# Altium project ECSC2024-pizza.PrjPcb
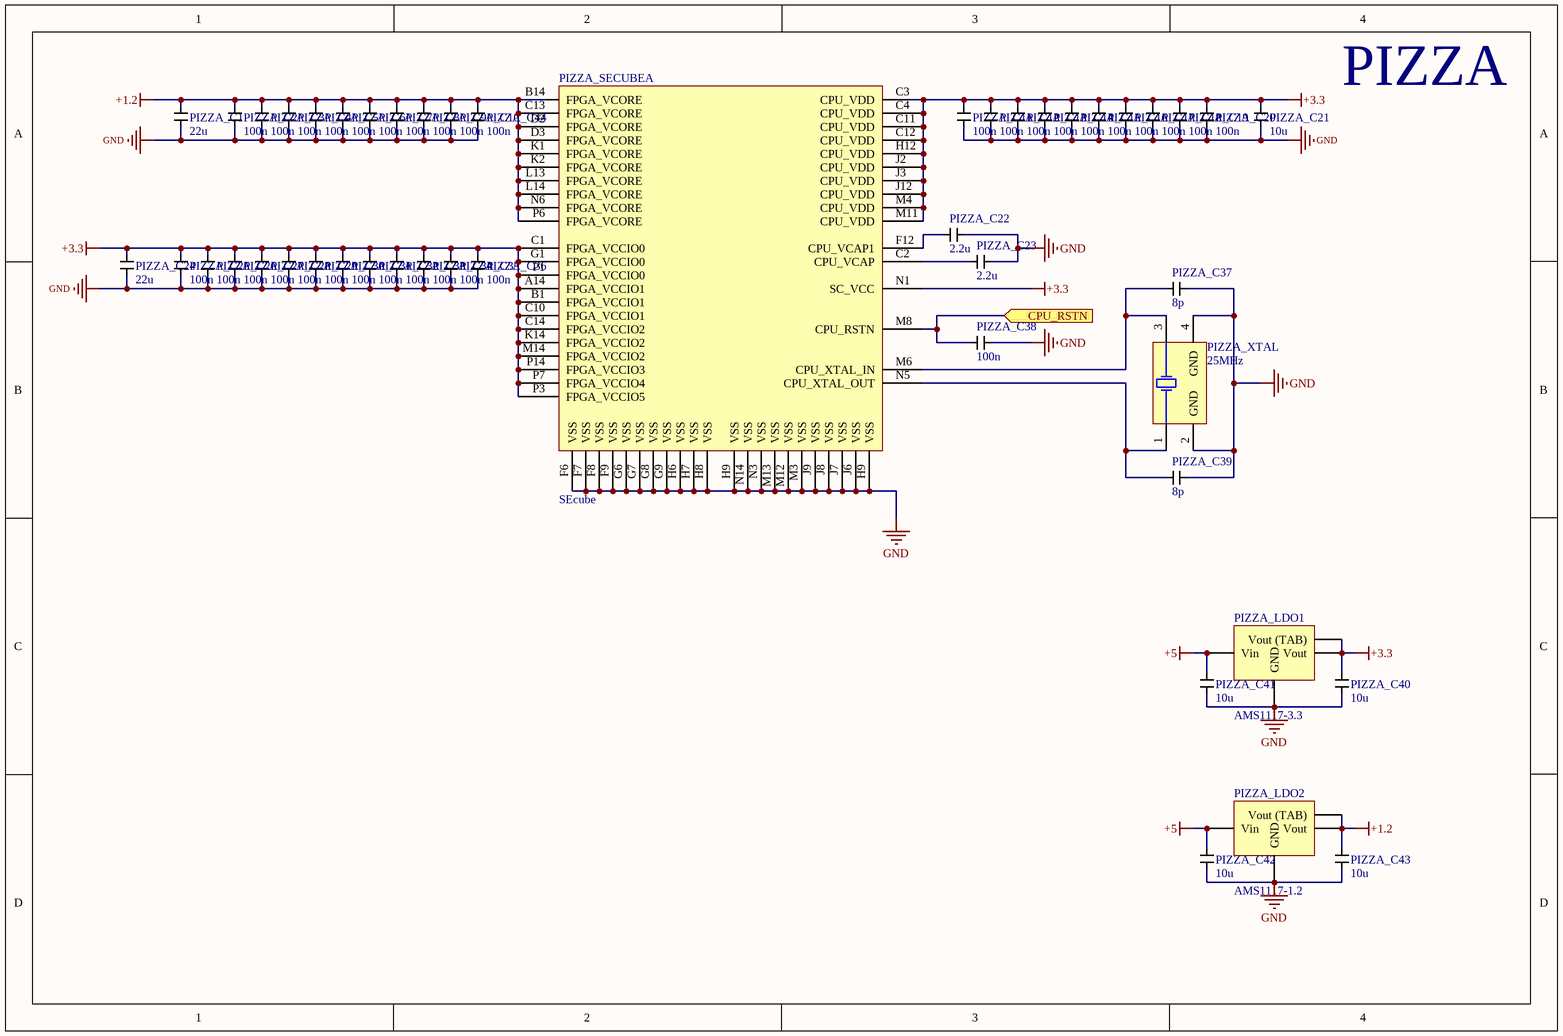
[diagram p0: Pizza BASE.SchDoc]
2 sheets, 75 parts. Net scope: flat (ports and power ports of the same name join across sheets).
Board files: Pizza.PcbDoc, PizzaFull.PcbDoc
Sheets:
  Pizza BASE.SchDoc
  Pizza IO.SchDoc

## Sheet Pizza BASE.SchDoc: Pizza CPU BASE
size A4; Author: Giovanni Minotti; SheetNumber: 1; SheetTotal: 2; ENG_APP_DATE: --/--/--; DSN_APP_DATE: --/--/--; CHK_APP_DATE: --/--/--

### Parts
PIZZA_C1  22u  [C0402]
PIZZA_C2  100n  [C0201]
PIZZA_C3  100n  [C0201]
PIZZA_C4  100n  [C0201]
PIZZA_C5  100n  [C0201]
PIZZA_C6  100n  [C0201]
PIZZA_C7  100n  [C0201]
PIZZA_C8  100n  [C0201]
PIZZA_C9  100n  [C0201]
PIZZA_C10  100n  [C0201]
PIZZA_C11  100n  [C0201]
PIZZA_C12  100n  [C0201]
PIZZA_C13  100n  [C0201]
PIZZA_C14  100n  [C0201]
PIZZA_C15  100n  [C0201]
PIZZA_C16  100n  [C0201]
PIZZA_C17  100n  [C0201]
PIZZA_C18  100n  [C0201]
PIZZA_C19  100n  [C0201]
PIZZA_C20  100n  [C0201]
PIZZA_C21  10u  [C0402]
PIZZA_C22  2.2u  [C0402]
PIZZA_C23  2.2u  [C0402]
PIZZA_C24  22u  [C0402]
PIZZA_C25  100n  [C0201]
PIZZA_C26  100n  [C0201]
PIZZA_C27  100n  [C0201]
PIZZA_C28  100n  [C0201]
PIZZA_C29  100n  [C0201]
PIZZA_C30  100n  [C0201]
PIZZA_C31  100n  [C0201]
PIZZA_C32  100n  [C0201]
PIZZA_C33  100n  [C0201]
PIZZA_C34  100n  [C0201]
PIZZA_C35  100n  [C0201]
PIZZA_C36  100n  [C0201]
PIZZA_C37  8p  [C0402]
PIZZA_C38  100n  [C0201]
PIZZA_C39  8p  [C0402]
PIZZA_C40  10u  [C0402]
PIZZA_C41  10u  [C0402]
PIZZA_C42  10u  [C0402]
PIZZA_C43  10u  [C0402]
PIZZA_C44  100n  [C0201]
PIZZA_LDO1  AMS1117-3.3  [SOT-223]
PIZZA_LDO2  AMS1117-1.2  [SOT-223]
PIZZA_SECUBE  SEcube  [SEcube]  (part A of 4)
PIZZA_XTAL  25MHz  [TSX-3225]

### Ports
CPU_RSTN (in, see Pizza IO[1C], Pizza IO[4D])

### Nets
+1.2: PIZZA_C1.2 PIZZA_C2.2 PIZZA_C3.2 PIZZA_C4.2 PIZZA_C5.2 PIZZA_C6.2 PIZZA_C7.2 PIZZA_C8.2 PIZZA_C9.2 PIZZA_C10.2 PIZZA_C43.2 PIZZA_C44.2 PIZZA_LDO2.3(Vout) PIZZA_LDO2.4(Vout_(TAB)) PIZZA_SECUBE.B14(FPGA_VCORE) PIZZA_SECUBE.C13(FPGA_VCORE) PIZZA_SECUBE.D2(FPGA_VCORE) PIZZA_SECUBE.D3(FPGA_VCORE) PIZZA_SECUBE.K1(FPGA_VCORE) PIZZA_SECUBE.K2(FPGA_VCORE) PIZZA_SECUBE.L13(FPGA_VCORE) PIZZA_SECUBE.L14(FPGA_VCORE) PIZZA_SECUBE.N6(FPGA_VCORE) PIZZA_SECUBE.P6(FPGA_VCORE)
+3.3: PIZZA_C11.2 PIZZA_C12.2 PIZZA_C13.2 PIZZA_C14.2 PIZZA_C15.2 PIZZA_C16.2 PIZZA_C17.2 PIZZA_C18.2 PIZZA_C19.2 PIZZA_C20.2 PIZZA_C21.2 PIZZA_C24.2 PIZZA_C25.2 PIZZA_C26.2 PIZZA_C27.2 PIZZA_C28.2 PIZZA_C29.2 PIZZA_C30.2 PIZZA_C31.2 PIZZA_C32.2 PIZZA_C33.2 PIZZA_C34.2 PIZZA_C35.2 PIZZA_C36.2 PIZZA_C40.2 PIZZA_LDO1.3(Vout) PIZZA_LDO1.4(Vout_(TAB)) PIZZA_SECUBE.A14(FPGA_VCCIO1) PIZZA_SECUBE.B1(FPGA_VCCIO1) PIZZA_SECUBE.C1(FPGA_VCCIO0) PIZZA_SECUBE.C3(CPU_VDD) PIZZA_SECUBE.C4(CPU_VDD) PIZZA_SECUBE.C10(FPGA_VCCIO1) PIZZA_SECUBE.C11(CPU_VDD) PIZZA_SECUBE.C12(CPU_VDD) PIZZA_SECUBE.C14(FPGA_VCCIO2) PIZZA_SECUBE.G1(FPGA_VCCIO0) PIZZA_SECUBE.H12(CPU_VDD) PIZZA_SECUBE.J2(CPU_VDD) PIZZA_SECUBE.J3(CPU_VDD) PIZZA_SECUBE.J12(CPU_VDD) PIZZA_SECUBE.K14(FPGA_VCCIO2) PIZZA_SECUBE.M4(CPU_VDD) PIZZA_SECUBE.M11(CPU_VDD) PIZZA_SECUBE.M14(FPGA_VCCIO2) PIZZA_SECUBE.N1(SC_VCC) PIZZA_SECUBE.P1(FPGA_VCCIO0) PIZZA_SECUBE.P3(FPGA_VCCIO5) PIZZA_SECUBE.P7(FPGA_VCCIO4) PIZZA_SECUBE.P14(FPGA_VCCIO3)
+5: PIZZA_C41.2 PIZZA_C42.2 PIZZA_LDO1.2(Vin) PIZZA_LDO2.2(Vin)
GND: PIZZA_C1.1 PIZZA_C2.1 PIZZA_C3.1 PIZZA_C4.1 PIZZA_C5.1 PIZZA_C6.1 PIZZA_C7.1 PIZZA_C8.1 PIZZA_C9.1 PIZZA_C10.1 PIZZA_C11.1 PIZZA_C12.1 PIZZA_C13.1 PIZZA_C14.1 PIZZA_C15.1 PIZZA_C16.1 PIZZA_C17.1 PIZZA_C18.1 PIZZA_C19.1 PIZZA_C20.1 PIZZA_C21.1 PIZZA_C22.1 PIZZA_C23.1 PIZZA_C24.1 PIZZA_C25.1 PIZZA_C26.1 PIZZA_C27.1 PIZZA_C28.1 PIZZA_C29.1 PIZZA_C30.1 PIZZA_C31.1 PIZZA_C32.1 PIZZA_C33.1 PIZZA_C34.1 PIZZA_C35.1 PIZZA_C36.1 PIZZA_C37.2 PIZZA_C38.1 PIZZA_C39.2 PIZZA_C40.1 PIZZA_C41.1 PIZZA_C42.1 PIZZA_C43.1 PIZZA_C44.1 PIZZA_LDO1.1(GND) PIZZA_LDO2.1(GND) PIZZA_SECUBE.F6(VSS) PIZZA_SECUBE.F7(VSS) PIZZA_SECUBE.F8(VSS) PIZZA_SECUBE.F9(VSS) PIZZA_SECUBE.G6(VSS) PIZZA_SECUBE.G7(VSS) PIZZA_SECUBE.G8(VSS) PIZZA_SECUBE.G9(VSS) PIZZA_SECUBE.H6(VSS) PIZZA_SECUBE.H7(VSS) PIZZA_SECUBE.H8(VSS) PIZZA_SECUBE.H9(VSS) PIZZA_SECUBE.J6(VSS) PIZZA_SECUBE.J7(VSS) PIZZA_SECUBE.J8(VSS) PIZZA_SECUBE.J9(VSS) PIZZA_SECUBE.M3(VSS) PIZZA_SECUBE.M12(VSS) PIZZA_SECUBE.M13(VSS) PIZZA_SECUBE.N3(VSS) PIZZA_SECUBE.N14(VSS) PIZZA_XTAL.2(GND) PIZZA_XTAL.4(GND)
NetPIZZA_C22_2: PIZZA_C22.2 PIZZA_SECUBE.F12(CPU_VCAP1)
NetPIZZA_C23_2: PIZZA_C23.2 PIZZA_SECUBE.C2(CPU_VCAP)
NetPIZZA_C37_1: PIZZA_C37.1 PIZZA_SECUBE.M6(CPU_XTAL_IN) PIZZA_XTAL.3(X2)
NetPIZZA_C38_2: PIZZA_C38.2 PIZZA_SECUBE.M8(CPU_RSTN) ; port CPU_RSTN
NetPIZZA_C39_1: PIZZA_C39.1 PIZZA_SECUBE.N5(CPU_XTAL_OUT) PIZZA_XTAL.1(X1)

### Notes on the sheet
- PIZZA
- DWG. NO.
- REV.
- SHT.
- THIS DOCUMENT AND THE DATA DISCLOSED HEREIN OR HEREWITH IS THE PROPERTY OF ALTIUM LIMITED AND MAY BE FREELY DISTRIBUTED IN WHOLE. NO RIGHTS ARE RESERVED OR EXPRESS OR IMPLIED WARANTEE GIVEN.
- REVISION
- DESCRIPTION
- DATE
- APPROVED
- ENG:
- APPROVALS
- PROJECT
- DSN:
- CHK:
- REFERENCE DOCUMENTS
- PROJECT REVISION:
- TITLE
- DOCUMENT REVISION:
- DESIGN ITEM:
- BOM:
- FAB DWG:
- PCB DWG:
- ASSY DWG:
- SCALE:
- SIZE
- B
- CAGE CODE
- FILE NAME
- DWG NO.
- SHEET
- OF
- REV

### Library data of the parts
PIZZA_C1-PIZZA_C44 = C
PIZZA_LDO1 PIZZA_LDO2 = LDO
PIZZA_XTAL = XTAL

## Sheet Pizza IO.SchDoc: Pizza CHALLENGES
size A4; Author: Giovanni Minotti; SheetNumber: 2; SheetTotal: 2
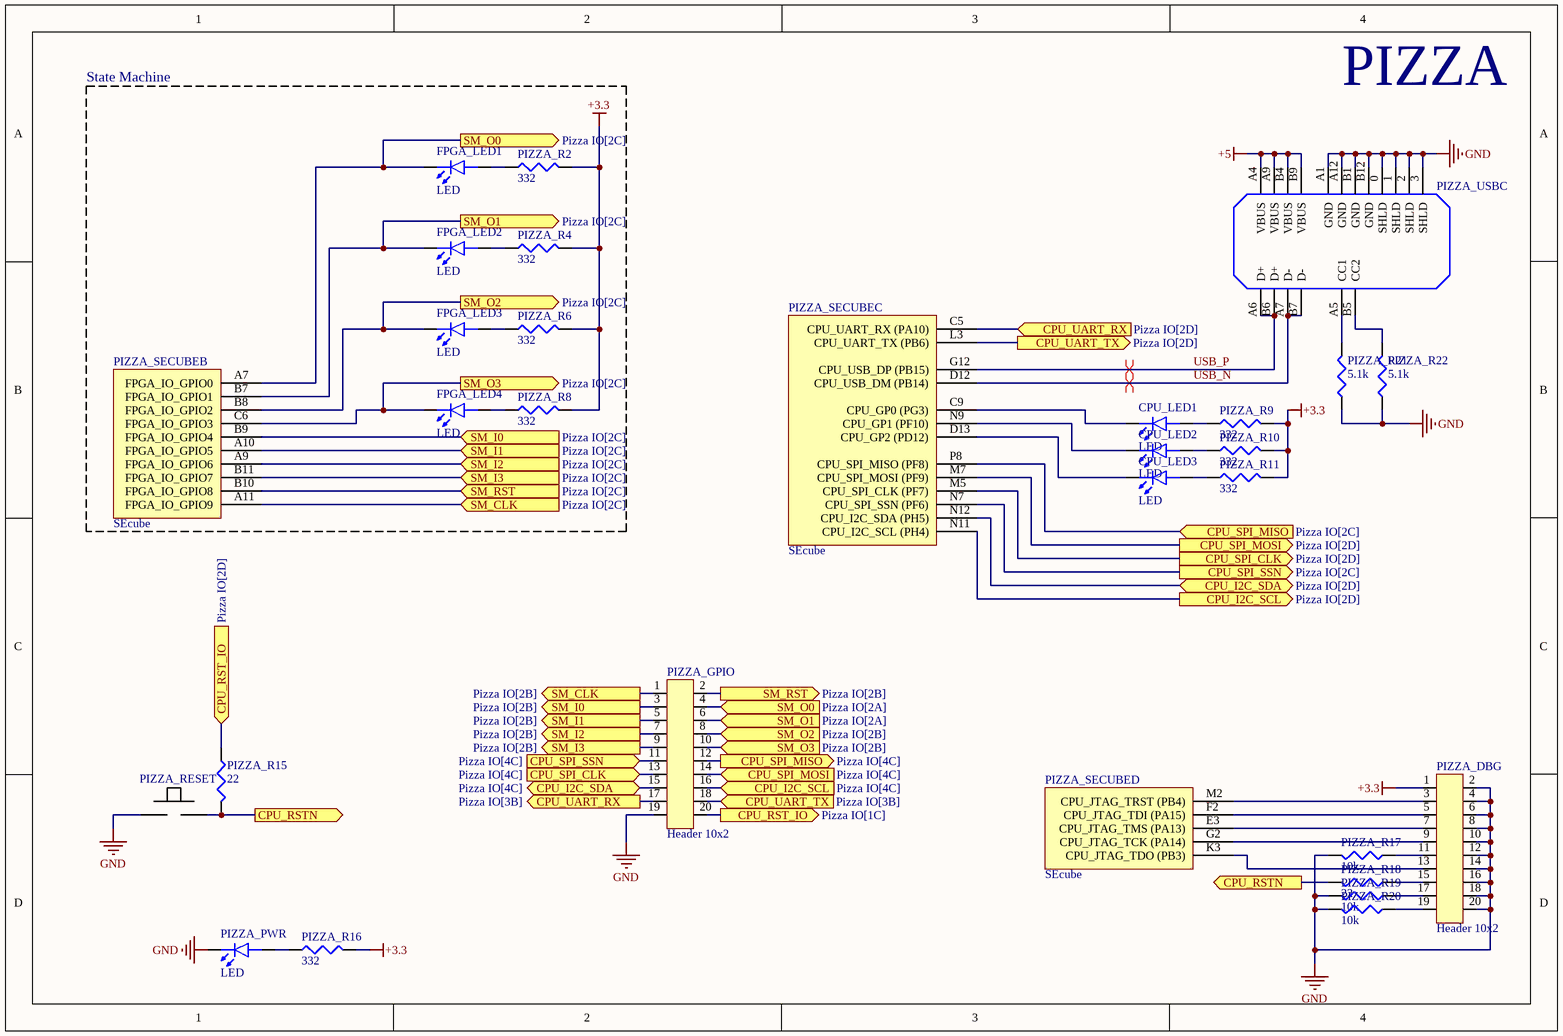
[diagram p1: Pizza IO.SchDoc]

### Parts
CPU_LED1  LED  [LED0603P]
CPU_LED2  LED  [LED0603P]
CPU_LED3  LED  [LED0603P]
FPGA_LED1  LED  [LED0603P]
FPGA_LED2  LED  [LED0603P]
FPGA_LED3  LED  [LED0603P]
FPGA_LED4  LED  [LED0603P]
PIZZA_DBG  Header 10x2  [HEADER10x2]
PIZZA_GPIO  Header 10x2  [HEADER10x2]
PIZZA_PWR  LED  [LED0603P]
PIZZA_R2  332  [R0402]
PIZZA_R4  332  [R0402]
PIZZA_R6  332  [R0402]
PIZZA_R8  332  [R0402]
PIZZA_R9  332  [R0402]
PIZZA_R10  332  [R0402]
PIZZA_R11  332  [R0402]
PIZZA_R15  22  [R0402]
PIZZA_R16  332  [R0402]
PIZZA_R17  10k  [R0402]
PIZZA_R18  22  [R0402]
PIZZA_R19  10k  [R0402]
PIZZA_R20  10k  [R0402]
PIZZA_R21  5.1k  [R0402]
PIZZA_R22  5.1k  [R0402]
PIZZA_RESET  BTN  [TS1088AR02016]  (value not drawn)
PIZZA_SECUBE  SEcube  [SEcube]  (parts B,C,D of 4)
PIZZA_USBC  USBC  [USB-TYPE-C-018]  (value not drawn)

### Blocks framed on the sheet
State Machine: FPGA_LED1-FPGA_LED4 PIZZA_R2 PIZZA_R4 PIZZA_R6 PIZZA_R8 PIZZA_SECUBE

### Ports
CPU_I2C_SCL (in, see Pizza IO[4C]), CPU_I2C_SCL (out, see Pizza IO[2D]), CPU_I2C_SDA (bidir, see Pizza IO[2D]), CPU_I2C_SDA (bidir, see Pizza IO[4C]), CPU_RST_IO (in, see Pizza IO[2D]), CPU_RST_IO (out, see Pizza IO[1C]), CPU_RSTN (out, see Pizza BASE[3B], Pizza IO[1D]), CPU_RSTN (out, see Pizza BASE[3B], Pizza IO[4D]), CPU_SPI_CLK (in, see Pizza IO[4C]), CPU_SPI_CLK (out, see Pizza IO[2D]), CPU_SPI_MISO (in, see Pizza IO[2C]), CPU_SPI_MISO (out, see Pizza IO[4C]), CPU_SPI_MOSI (in, see Pizza IO[4C]), CPU_SPI_MOSI (out, see Pizza IO[2D]), CPU_SPI_SSN (in, see Pizza IO[4C]), CPU_SPI_SSN (out, see Pizza IO[2C]), CPU_UART_RX (in, see Pizza IO[2D]), CPU_UART_RX (out, see Pizza IO[3B]), CPU_UART_TX (in, see Pizza IO[3B]), CPU_UART_TX (out, see Pizza IO[2D]), SM_CLK (in, see Pizza IO[2C]), SM_CLK (out, see Pizza IO[2B]), SM_I0 (in, see Pizza IO[2C]), SM_I0 (out, see Pizza IO[2B]), SM_I1 (in, see Pizza IO[2C]), SM_I1 (out, see Pizza IO[2B]), SM_I2 (in, see Pizza IO[2C]), SM_I2 (out, see Pizza IO[2B]), SM_I3 (in, see Pizza IO[2C]), SM_I3 (out, see Pizza IO[2B]), SM_O0 (in, see Pizza IO[2A]), SM_O0 (out, see Pizza IO[2C]), SM_O1 (in, see Pizza IO[2A]), SM_O1 (out, see Pizza IO[2C]), SM_O2 (in, see Pizza IO[2B]), SM_O2 (out, see Pizza IO[2C]), SM_O3 (in, see Pizza IO[2B]), SM_O3 (out, see Pizza IO[2C]), SM_RST (in, see Pizza IO[2C]), SM_RST (out, see Pizza IO[2B])

### Nets
+3.3: PIZZA_DBG.1 PIZZA_R2.2 PIZZA_R4.2 PIZZA_R6.2 PIZZA_R8.2 PIZZA_R9.2 PIZZA_R10.2 PIZZA_R11.2 PIZZA_R16.2
+5: PIZZA_USBC.A4(VBUS) PIZZA_USBC.A9(VBUS) PIZZA_USBC.B4(VBUS) PIZZA_USBC.B9(VBUS)
GND: PIZZA_DBG.2 PIZZA_DBG.4 PIZZA_DBG.6 PIZZA_DBG.8 PIZZA_DBG.10 PIZZA_DBG.12 PIZZA_DBG.14 PIZZA_DBG.16 PIZZA_DBG.18 PIZZA_DBG.20 PIZZA_GPIO.19 PIZZA_PWR.2(K) PIZZA_R17.2 PIZZA_R19.2 PIZZA_R20.2 PIZZA_R21.1 PIZZA_R22.1 PIZZA_RESET.1 PIZZA_USBC.0(SHLD) PIZZA_USBC.1(SHLD) PIZZA_USBC.2(SHLD) PIZZA_USBC.3(SHLD) PIZZA_USBC.A1(GND) PIZZA_USBC.A12(GND) PIZZA_USBC.B1(GND) PIZZA_USBC.B12(GND)
USB_N: PIZZA_SECUBE.D12(CPU_USB_DM_(PB14)) PIZZA_USBC.A7(D-) PIZZA_USBC.B7(D-)
USB_P: PIZZA_SECUBE.G12(CPU_USB_DP_(PB15)) PIZZA_USBC.A6(D+) PIZZA_USBC.B6(D+)
NetCPU_LED1_1: CPU_LED1.1(A) PIZZA_R9.1
NetCPU_LED1_2: CPU_LED1.2(K) PIZZA_SECUBE.C9(CPU_GP0_(PG3))
NetCPU_LED2_1: CPU_LED2.1(A) PIZZA_R10.1
NetCPU_LED2_2: CPU_LED2.2(K) PIZZA_SECUBE.N9(CPU_GP1_(PF10))
NetCPU_LED3_1: CPU_LED3.1(A) PIZZA_R11.1
NetCPU_LED3_2: CPU_LED3.2(K) PIZZA_SECUBE.D13(CPU_GP2_(PD12))
NetFPGA_LED1_1: FPGA_LED1.1(A) PIZZA_R2.1
NetFPGA_LED1_2: FPGA_LED1.2(K) PIZZA_GPIO.4 PIZZA_SECUBE.A7(FPGA_IO_GPIO0) ; port SM_O0
NetFPGA_LED2_1: FPGA_LED2.1(A) PIZZA_R4.1
NetFPGA_LED2_2: FPGA_LED2.2(K) PIZZA_GPIO.6 PIZZA_SECUBE.B7(FPGA_IO_GPIO1) ; port SM_O1
NetFPGA_LED3_1: FPGA_LED3.1(A) PIZZA_R6.1
NetFPGA_LED3_2: FPGA_LED3.2(K) PIZZA_GPIO.8 PIZZA_SECUBE.B8(FPGA_IO_GPIO2) ; port SM_O2
NetFPGA_LED4_1: FPGA_LED4.1(A) PIZZA_R8.1
NetFPGA_LED4_2: FPGA_LED4.2(K) PIZZA_GPIO.10 PIZZA_SECUBE.C6(FPGA_IO_GPIO3) ; port SM_O3
NetPIZZA_C38_2: PIZZA_R15.2 PIZZA_R18.2 PIZZA_RESET.2 ; port CPU_RSTN
NetPIZZA_DBG_3: PIZZA_DBG.3 PIZZA_SECUBE.M2(CPU_JTAG_TRST_(PB4))
NetPIZZA_DBG_5: PIZZA_DBG.5 PIZZA_SECUBE.F2(CPU_JTAG_TDI_(PA15))
NetPIZZA_DBG_7: PIZZA_DBG.7 PIZZA_SECUBE.E3(CPU_JTAG_TMS_(PA13))
NetPIZZA_DBG_9: PIZZA_DBG.9 PIZZA_SECUBE.G2(CPU_JTAG_TCK_(PA14))
NetPIZZA_DBG_11: PIZZA_DBG.11 PIZZA_R17.1
NetPIZZA_DBG_13: PIZZA_DBG.13 PIZZA_SECUBE.K3(CPU_JTAG_TDO_(PB3))
NetPIZZA_DBG_15: PIZZA_DBG.15 PIZZA_R18.1
NetPIZZA_DBG_17: PIZZA_DBG.17 PIZZA_R19.1
NetPIZZA_DBG_19: PIZZA_DBG.19 PIZZA_R20.1
NetPIZZA_GPIO_1: PIZZA_GPIO.1 PIZZA_SECUBE.A11(FPGA_IO_GPIO9) ; port SM_CLK
NetPIZZA_GPIO_2: PIZZA_GPIO.2 PIZZA_SECUBE.B10(FPGA_IO_GPIO8) ; port SM_RST
NetPIZZA_GPIO_3: PIZZA_GPIO.3 PIZZA_SECUBE.B9(FPGA_IO_GPIO4) ; port SM_I0
NetPIZZA_GPIO_5: PIZZA_GPIO.5 PIZZA_SECUBE.A10(FPGA_IO_GPIO5) ; port SM_I1
NetPIZZA_GPIO_7: PIZZA_GPIO.7 PIZZA_SECUBE.A9(FPGA_IO_GPIO6) ; port SM_I2
NetPIZZA_GPIO_9: PIZZA_GPIO.9 PIZZA_SECUBE.B11(FPGA_IO_GPIO7) ; port SM_I3
NetPIZZA_GPIO_11: PIZZA_GPIO.11 PIZZA_SECUBE.N7(CPU_SPI_SSN_(PF6)) ; port CPU_SPI_SSN
NetPIZZA_GPIO_12: PIZZA_GPIO.12 PIZZA_SECUBE.P8(CPU_SPI_MISO_(PF8)) ; port CPU_SPI_MISO
NetPIZZA_GPIO_13: PIZZA_GPIO.13 PIZZA_SECUBE.M5(CPU_SPI_CLK_(PF7)) ; port CPU_SPI_CLK
NetPIZZA_GPIO_14: PIZZA_GPIO.14 PIZZA_SECUBE.M7(CPU_SPI_MOSI_(PF9)) ; port CPU_SPI_MOSI
NetPIZZA_GPIO_15: PIZZA_GPIO.15 PIZZA_SECUBE.N12(CPU_I2C_SDA_(PH5)) ; port CPU_I2C_SDA
NetPIZZA_GPIO_16: PIZZA_GPIO.16 PIZZA_SECUBE.N11(CPU_I2C_SCL_(PH4)) ; port CPU_I2C_SCL
NetPIZZA_GPIO_17: PIZZA_GPIO.17 PIZZA_SECUBE.C5(CPU_UART_RX_(PA10)) ; port CPU_UART_RX
NetPIZZA_GPIO_18: PIZZA_GPIO.18 PIZZA_SECUBE.L3(CPU_UART_TX_(PB6)) ; port CPU_UART_TX
NetPIZZA_GPIO_20: PIZZA_GPIO.20 PIZZA_R15.1 ; port CPU_RST_IO
NetPIZZA_PWR_1: PIZZA_PWR.1(A) PIZZA_R16.1
NetPIZZA_R21_2: PIZZA_R21.2 PIZZA_USBC.A5(CC1)
NetPIZZA_R22_2: PIZZA_R22.2 PIZZA_USBC.B5(CC2)

### Layout directives
differential pair: USB_N, USB_P

### Notes on the sheet
- PIZZA

### Library data of the parts
PIZZA_R2 PIZZA_R4 PIZZA_R6 PIZZA_R8-PIZZA_R11 PIZZA_R15-PIZZA_R22 = R

## Nets that join several sheets
+3.3: Pizza BASE (50 pins), Pizza IO (9 pins)
+5: Pizza BASE (PIZZA_C41.2 PIZZA_C42.2 PIZZA_LDO1.2 PIZZA_LDO2.2), Pizza IO (PIZZA_USBC.A4 PIZZA_USBC.A9 PIZZA_USBC.B4 PIZZA_USBC.B9)
GND: Pizza BASE (69 pins), Pizza IO (26 pins)
NetPIZZA_C38_2: Pizza BASE (PIZZA_C38.2 PIZZA_SECUBE.M8), Pizza IO (PIZZA_R15.2 PIZZA_R18.2 PIZZA_RESET.2)